# Altium schematic sheet STMwithBut_sch.SchDoc
size A4; SheetNumber: 1; SheetTotal: 1; SPICEModelCacheMLVSDTCZ: <root> / <DocumentId>MLVSDTCZ</DocumentId> / </root>
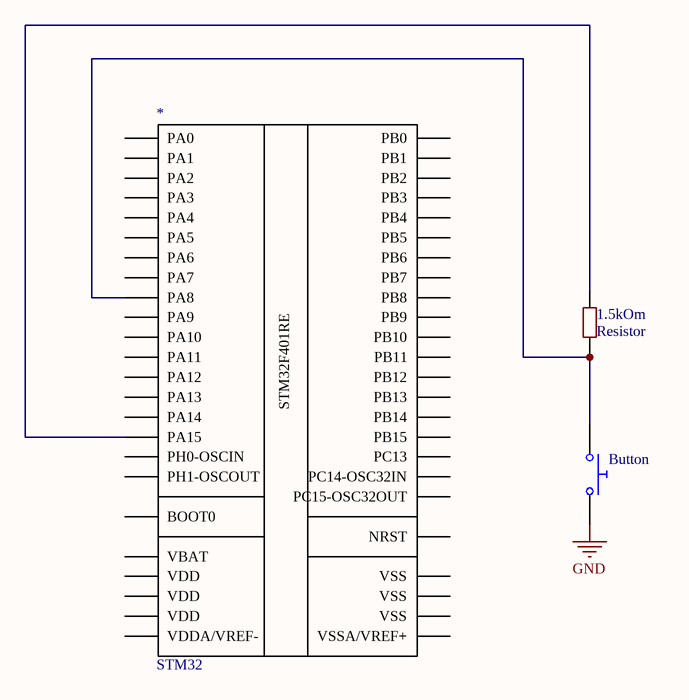
[diagram p0: STMwithBut_sch.SchDoc]

## Parts
1.5kOm  Resistor
*  STM32
Button  Push Button Normally Opened  (value not drawn)

## Nets
GND: Button.2
Net1.5kOm_8: 1.5kOm.8 *.?9(PA8) Button.1
Net1.5kOm_9: 1.5kOm.9 *.?16(PA15)

Not connected (* = marked no-connect by the designer): * ?1(PA0) ?2(PA1) ?3(PA2) ?4(PA3) ?5(PA4) ?6(PA5) ?7(PA6) ?8(PA7) ?10(PA9) ?11(PA10) ?12(PA11) ?13(PA12) ?14(PA13) ?15(PA14) ?17(PH0-OSCIN) ?18(PH1-OSCOUT) ?19(BOOT0) ?20(VBAT) ?21(VDD) ?22(VDD) ?23(VDD) ?24(VDDA/VREF-) ?25(PB0) ?26(PB1) ?27(PB2) ?28(PB3) ?29(PB4) ?30(PB5) ?31(PB6) ?32(PB7) ?33(PB8) ?34(PB9) ?35(PB10) ?36(PB11) ?37(PB12) ?38(PB13) ?39(PB14) ?40(PB15) ?41(PC13) ?42(PC14-OSC32IN) ?43(PC15-OSC32OUT) ?44(NRST) ?45(VSS) ?46(VSS) ?47(VSS) ?48(VSSA/VREF+)

## Notes on the sheet
- (in symbol Component_1) STM32F401RE

## Library data of the parts
1.5kOm * = Component_1
Button = Push Button NO: closed: 0; Rclosed: 1m; Ropen: 1Meg; SimulationGenericComponent: True